# EAGLE design Adafruit NeoKey FeatherWing (EAGLE 9.6.2)
COMPANY: ADAFRUIT INDUSTRIES; DRAWN: KTOWN; REV: A
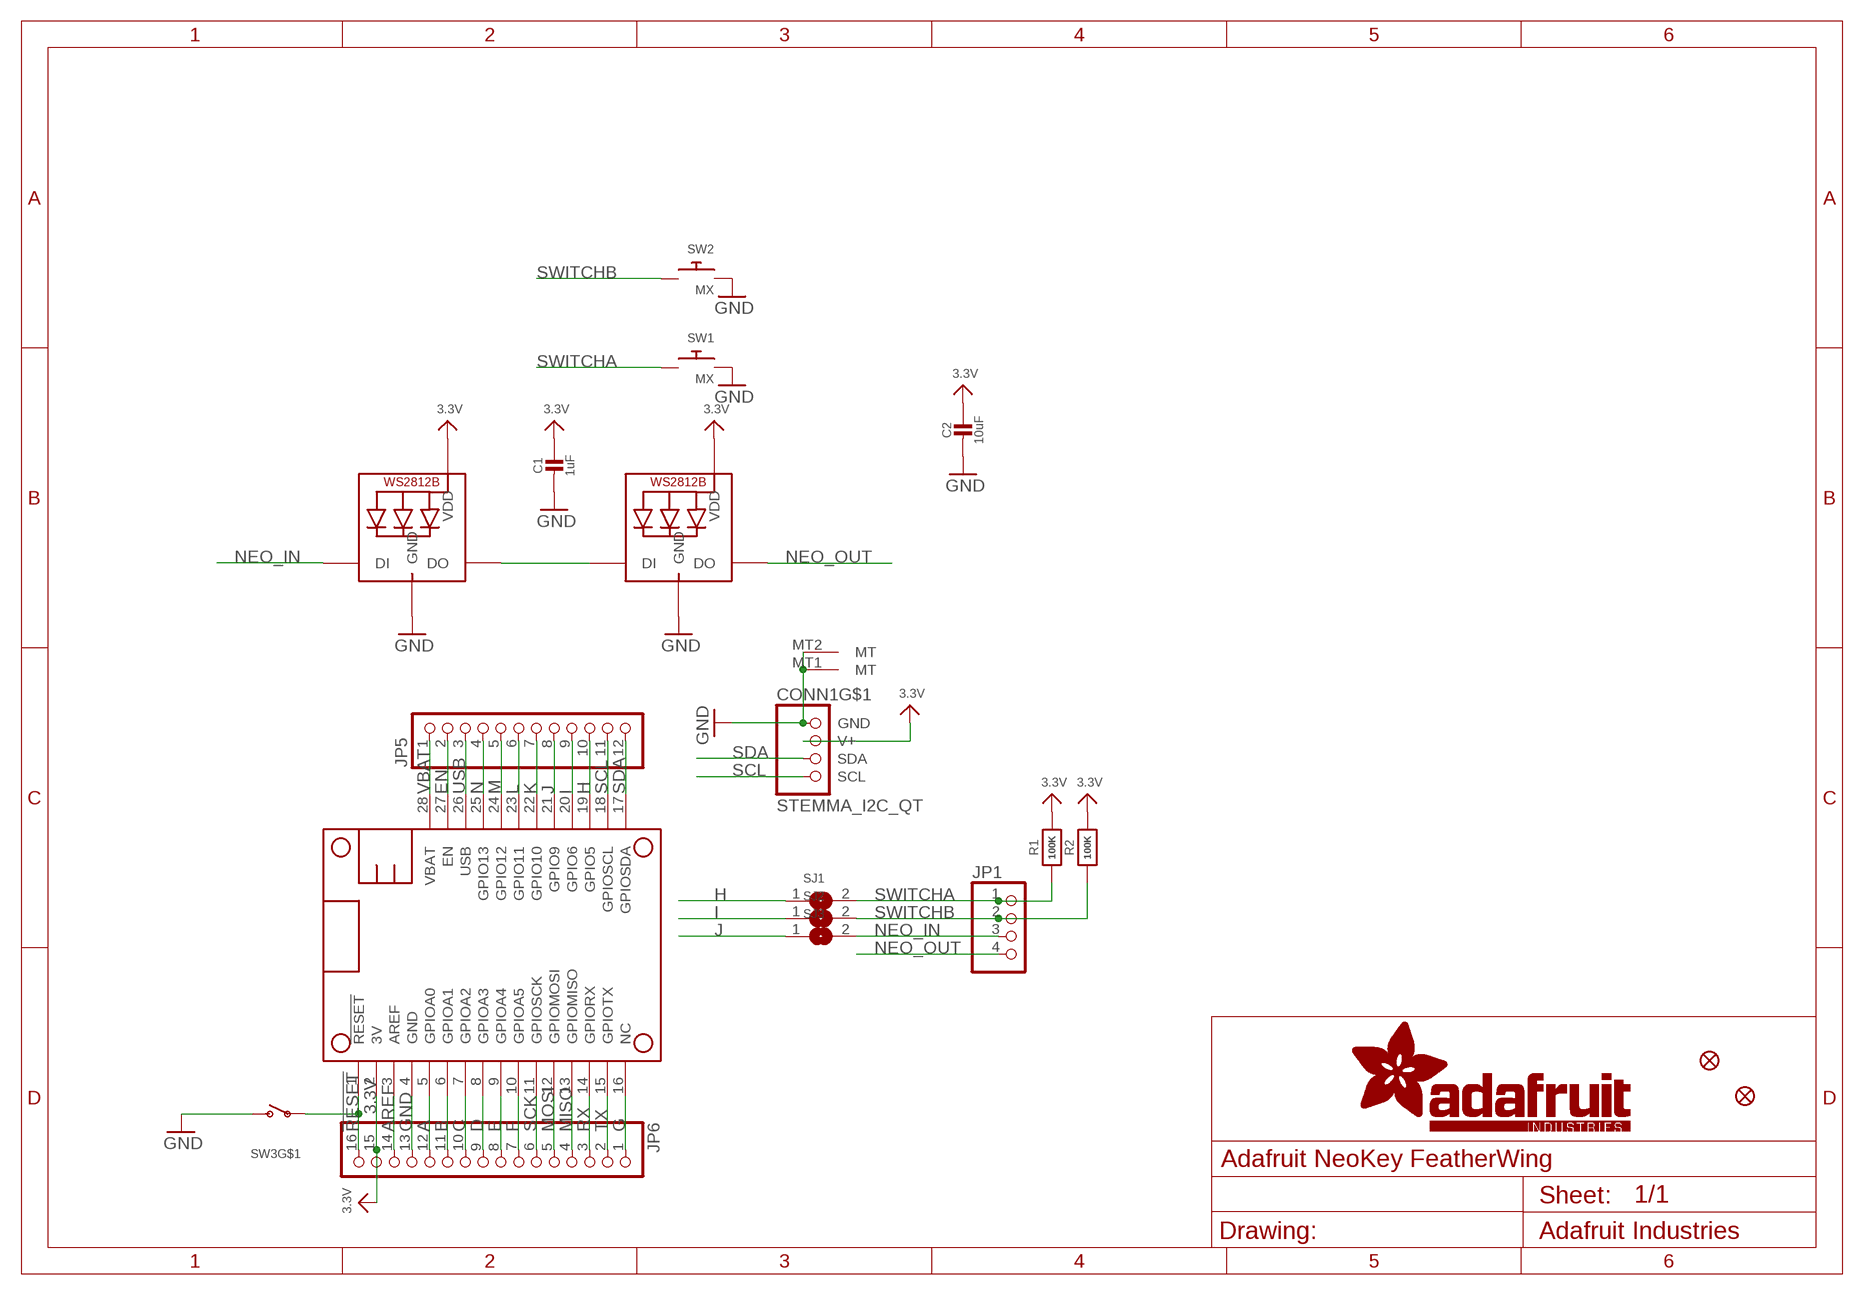
[diagram p0: schematic, sheet 1]

## Parts
C1  1uF  CAP_CERAMIC0603_NO  [0603-NO]
C2  10uF  CAP_CERAMIC0805-NOOUTLINE  [0805-NO]
CONN1  STEMMA_I2C_QT  [JST_SH4]
FID1  FIDUCIAL_1MM  [FIDUCIAL_1MM]
FID2  FIDUCIAL_1MM  [FIDUCIAL_1MM]
JP1  HEADER-1X4ROUND  [1X04_ROUND]
JP5  HEADER-1X12  [1X12_ROUND]
JP6  HEADER-1X16ROUND  [1X16_ROUND]
LED1  WS2812B_SK6812E  [NEO3535_REVERSE]
LED2  WS2812B_SK6812E  [NEO3535_REVERSE]
MS1  FEATHERWING_NODIM  [FEATHERWING_NODIM]
R1  100K  RESISTOR_0603_NOOUT  [0603-NO]
R2  100K  RESISTOR_0603_NOOUT  [0603-NO]
SJ1  SOLDERJUMPERCLOSED  [SOLDERJUMPER_CLOSEDWIRE]
SJ2  SOLDERJUMPERCLOSED  [SOLDERJUMPER_CLOSEDWIRE]
SJ3  SOLDERJUMPERCLOSED  [SOLDERJUMPER_CLOSEDWIRE]
SW1  MX  SWITCH_PUSHBUTTON_KAILH_SOCKET  [KAILH_SOCKET]
SW2  MX  SWITCH_PUSHBUTTON_KAILH_SOCKET  [KAILH_SOCKET]
SW3  SWITCH_SPST_TACT_RA  [SPST_TACTILE_RA]

## Nets
3.3V: C1.1 C2.1 CONN1.2(V+) JP6.15 LED1.1-VDD(VDD) LED2.1-VDD(VDD) MS1.2(3V) R1.2 R2.2
!RESET: JP6.16 MS1.1(!RESET) SW3.1(P)
A: JP6.12 MS1.5(GPIOA0)
AREF: JP6.14 MS1.3(AREF)
B: JP6.11 MS1.6(GPIOA1)
C: JP6.10 MS1.7(GPIOA2)
D: JP6.9 MS1.8(GPIOA3)
E: JP6.8 MS1.9(GPIOA4)
EN: JP5.2 MS1.27(EN)
F: JP6.7 MS1.10(GPIOA5)
G: JP6.1 MS1.16(NC)
GND: C1.2 C2.2 CONN1.1(GND) CONN1.MT1(MT) CONN1.MT2(MT) JP6.13 LED1.3-GND(GND) LED2.3-GND(GND) MS1.4(GND) SW1.1 SW2.1 SW3.2(S)
H: JP5.10 MS1.19(GPIO5) SJ1.1
I: JP5.9 MS1.20(GPIO6) SJ2.1
J: JP5.8 MS1.21(GPIO9) SJ3.1
K: JP5.7 MS1.22(GPIO10)
L: JP5.6 MS1.23(GPIO11)
M: JP5.5 MS1.24(GPIO12)
MISO: JP6.4 MS1.13(GPIOMISO)
MOSI: JP6.5 MS1.12(GPIOMOSI)
N: JP5.4 MS1.25(GPIO13)
N$26: LED1.4-DIN(DI) LED2.2-DOUT(DO)
NEO_IN: JP1.3 LED2.4-DIN(DI) SJ3.2
NEO_OUT: JP1.4 LED1.2-DOUT(DO)
RX: JP6.3 MS1.14(GPIORX)
SCK: JP6.6 MS1.11(GPIOSCK)
SCL: CONN1.4(SCL) JP5.11 MS1.18(GPIOSCL)
SDA: CONN1.3(SDA) JP5.12 MS1.17(GPIOSDA)
SWITCHA: JP1.1 R1.1 SJ1.2 SW1.2
SWITCHB: JP1.2 R2.1 SJ2.2 SW2.2
TX: JP6.2 MS1.15(GPIOTX)
USB: JP5.3 MS1.26(USB)
VBAT: JP5.1 MS1.28(VBAT)
Unconnected: SW3.MT1(MT) SW3.MT2(MT)

## Library data of the parts
C1 C2 = microbuilder:CAP_CERAMIC: Ceramic Capacitors For new designs, use the packages preceded by an '_' character since they are more reliable: The following footprints should be used on most boards: _0402 - Standard footprint for regular board layouts _0603 - Standard footprint for regular board layouts _0805 - Standard footprint for regular board layouts _1206 - Standard footprint for regular board layouts For extremely tight-pitch boards where space is at a premium, the following 'micro-pitch' footprints can be used (smaller pads, no silkscreen outline, etc.): _0402MP - Micro-pitch footprint for very dense/compact boards _0603MP - Micro-pitch footprint for very dense/compact boards _0805MP - Micro-pitch footprint for very dense/compact boards _1206MP - Micro-pitch footprint for very dense/compact boards
CONN1 = microbuilder:STEMMA_I2C
FID1 FID2 = microbuilder:FIDUCIAL: Fiducial Alignment Points Various fiducial points for machine vision alignment.; BOM: EXCLUDE
JP1 = microbuilder:HEADER-1X4: PIN HEADER
JP5 = microbuilder:HEADER-1X12
JP6 = microbuilder:HEADER-1X16: PIN HEADER
LED1 LED2 = microbuilder:WS2812B
MS1 = microbuilder:FEATHERWING
R1 R2 = microbuilder:RESISTOR: Resistors For new designs, use the packages preceded by an '_' character since they are more reliable: The following footprints should be used on most boards: _0402 - Standard footprint for regular board layouts _0603 - Standard footprint for regular board layouts _0805 - Standard footprint for regular board layouts _1206 - Standard footprint for regular board layouts For extremely tight-pitch boards where space is at a premium, the following 'micro-pitch' footprints can be used (smaller pads, no silkscreen outline, etc.): _0402MP - Micro-pitch footprint for very dense/compact boards _0603MP - Micro-pitch footprint for very dense/compact boards _0805MP - Micro-pitch footprint for very dense/compact boards _1206MP - Micro-pitch footprint for very dense/compact boards
SJ1-SJ3 = microbuilder:SOLDERJUMPER: SMD Solder JUMPER Solder the two pads together to create a connection, or remove the solder to break it. REFLOW - Use this footprint for solder paste and reflow ovens. WAVE - Use this footprint for hand-soldering (larger pads). CLOSED - Has a trace between the two pads to ensure it is closed by default. The trace needs to be cut to disable the jumper, and can be closed again by creating a solder bridge between the two pads.
SW1 SW2 = adafruit_electromech:SWITCH_PUSHBUTTON: Buttons SOFTTOUCHSMD_SJ - Soft touch temporary push button (Super Junk Akihabara) Compatible with SKPMANE010 [Mouser: 688-SKPMAN] C&K_KSS = Digikey: KSS221GLFS
SW3 = adafruit_electromech:SWITCH_SPST: Switch - SPST 4UCon 19192 (6.7x2.6mm SMT)

## Net classes
1 highpower: width 0.305 mm, drill 0.483 mm
2 lowpower: width 0.254 mm, drill 0.483 mm

## Board
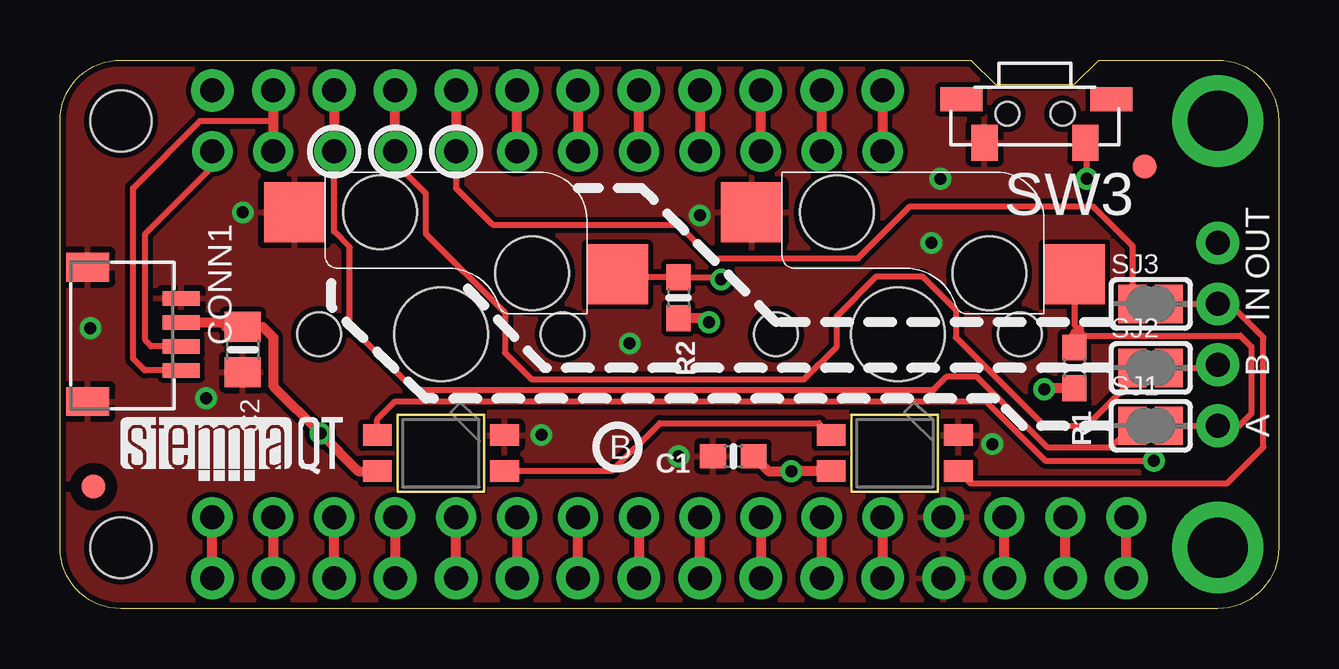
[diagram p1: board, top side]
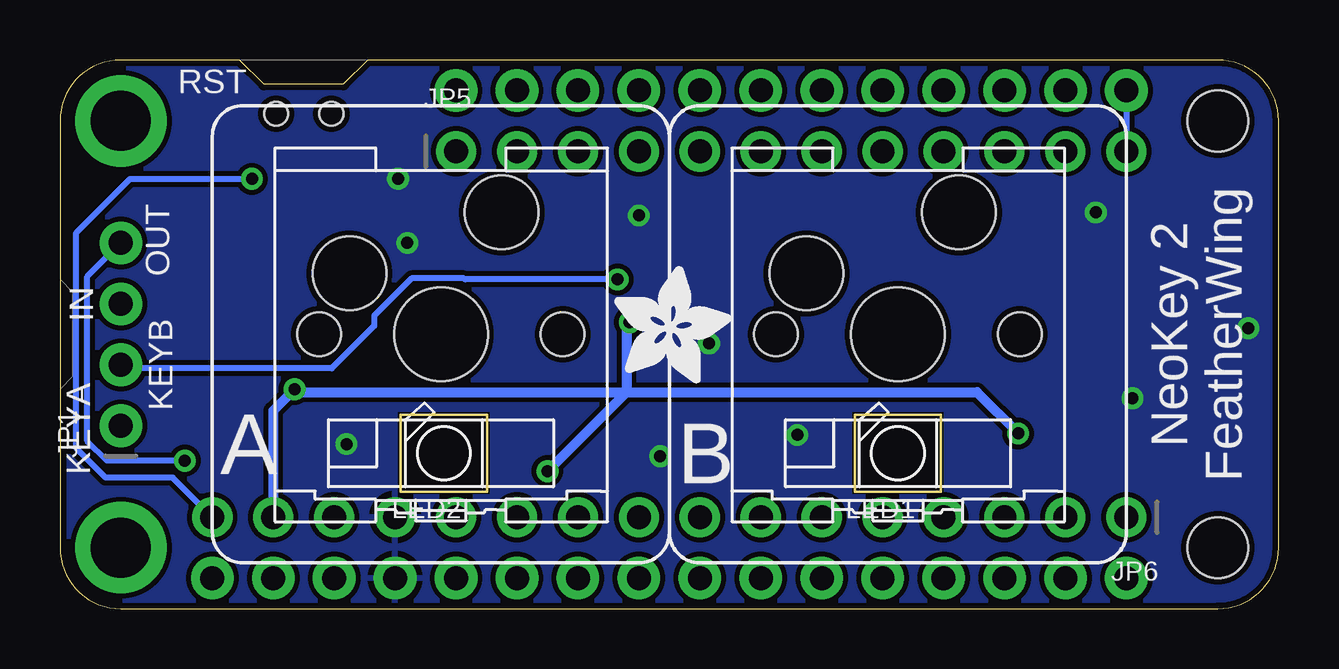
[diagram p2: board, bottom side, seen from below]

Size 50.8 x 22.86 mm. Coordinates in mm from the lower left corner, seen from the top.
Outline: 48.26,0 2.54,0 arc-90 0,2.54 0,20.32 arc-90 2.54,22.86 37.97,22.86 38.99,21.84 42.29,21.84 43.31,22.86 48.26,22.86 arc-90 50.8,20.32 50.8,2.54 arc-90 48.26,0
Copper layers (1*16): Top 0.035mm / dielectric 1.5mm / Bottom 0.035mm
Design rules "adafruit *": minimum track width 8mil, minimum drill 15.5mil, track to track 8mil, track to pad 8mil, pad to pad 8mil, via to via 8mil, smd to smd 8mil, copper to edge 10mil, drill to drill 8mil, minimum pad ring 10mil, minimum via ring 8mil, stop-mask expansion 2mil, vias tented up to drill 20mil, thermal gap 10mil

### Footprints (pad centres in the part's own frame; a part is rotated, then mirrored left to right if it is on the bottom)
0603-NO = smd 1.075 x 1: 1 -0.85,0; 2 0.85,0
0805-NO = smd 1.24 x 1.5: 1 -0.95,0; 2 0.95,0
JST_SH4 = smd 0.6 x 1.55: 1 -1.5,2.514; 2 -0.5,2.514; 3 0.5,2.514; 4 1.5,2.514 | smd 1.2 x 1.8: MT1 -2.8,-1.386; MT2 2.8,-1.386
FIDUCIAL_1MM = smd 1 x 1: 1 0,0
1X04_ROUND = drill 1 pad 1.778: 1 -3.81,0; 2 -1.27,0; 3 1.27,0; 4 3.81,0
1X12_ROUND = drill 1 pad 1.676: 1 -13.97,0; 2 -11.43,0; 3 -8.89,0; 4 -6.35,0; 5 -3.81,0; 6 -1.27,0; 7 1.27,0; 8 3.81,0; 9 6.35,0; 10 8.89,0; 11 11.43,0; 12 13.97,0
1X16_ROUND = drill 1 pad 1.676: 1 -19.05,0; 2 -16.51,0; 3 -13.97,0; 4 -11.43,0; 5 -8.89,0; 6 -6.35,0; 7 -3.81,0; 8 -1.27,0; 9 1.27,0; 10 3.81,0; 11 6.35,0; 12 8.89,0; 13 11.43,0; 14 13.97,0; 15 16.51,0; 16 19.05,0
NEO3535_REVERSE = smd 1.2 x 0.9 bottom: 1-VDD 2.65,-0.75; 2-DOUT 2.65,0.75; 3-GND -2.65,0.75; 4-DIN -2.65,-0.75
FEATHERWING_NODIM = drill 1 pad 1.778: 1 6.35,1.27; 2 8.89,1.27; 3 11.43,1.27; 4 13.97,1.27; 5 16.51,1.27; 6 19.05,1.27; 7 21.59,1.27; 8 24.13,1.27; 9 26.67,1.27; 10 29.21,1.27; 11 31.75,1.27; 12 34.29,1.27; 13 36.83,1.27; 14 39.37,1.27; 15 41.91,1.27; 16 44.45,1.27; 17 44.45,21.59; 18 41.91,21.59; 19 39.37,21.59; 20 36.83,21.59; 21 34.29,21.59; 22 31.75,21.59; 23 29.21,21.59; 24 26.67,21.59; 25 24.13,21.59; 26 21.59,21.59; 27 19.05,21.59; 28 16.51,21.59 | drill 2.5 pad 3.81: P$1 2.54,20.32; P$2 2.54,2.54 | hole 2.54: 48.26,20.32; 48.26,2.54
SOLDERJUMPER_CLOSEDWIRE = smd 1.168 x 1.6: 1 -0.762,0; 2 0.762,0 | smd 0.635 x 0.203: WIRE 0,0
KAILH_SOCKET = smd 2.55 x 2.5 bottom: 1 6.09,5.08; 2 -7.36,2.5 | hole 3.9: 0,0 | hole 3.063: 2.54,5.08; -3.81,2.54 | hole 1.813: 5.08,0; -5.08,0
SPST_TACTILE_RA = smd 1.1 x 1.5: 1 -2.1,0.9; 2 2.1,0.9 | smd 1.75 x 1: MT1 -3.175,-0.9; MT2 3.075,-0.9 | hole 1: -1.15,-0.3; 1.15,-0.3

### Placement (x,y rotation side)
C1  28.07,6.35 180 top
C2  7.62,10.79 270 top
CONN1  2.54,11.43 270 top
FID1  45.21,18.41 0 top
FID2  1.4,5.08 0 top
JP1  48.26,11.43 90 bottom
JP5  20.32,19.05 0 bottom
JP6  25.4,3.81 180 bottom
LED1  15.88,6.48 0 bottom
LED2  34.8,6.48 0 bottom
MS1  50.8,0 0 bottom
R1  42.29,10.03 270 top
R2  25.78,12.95 270 top
SJ1  45.47,7.62 0 top
SJ2  45.47,10.03 0 top
SJ3  45.47,12.7 0 top
SW1  34.92,11.43 0 bottom
SW2  15.88,11.43 0 bottom
SW3  40.64,20.32 180 top
U$7  [ADAFRUIT_5MM]  27.69,9.4 0 bottom
U$8  [PCBFEAT-REV-040]  23.24,6.73 0 top
U$11  [STEMMAQT]  2.54,5.33 0 top

### Tracks (layer width: path | path; a pad name or v marks a point on that pad's centre or on a via)
3.3V  (via drill 0.5)
  Top 0.406: MS1.2 JP6.15 | LED2.1-VDD v30.48,5.73 29.54,5.73 C1.1 | v27.05,11.94 26.92,11.94 26.76,12.1 R2.2 | CONN1.2 6.74,11.93 6.92,11.74 C2.1 8.45,11.74 8.89,11.3 8.89,9.27 v10.86,7.3 12.43,5.73 LED1.1-VDD | R1.2 41.06,9.18 v41.02,9.14
  Bottom 0.406: v30.48,5.73 27.19,9.02 | v27.05,11.94 27.18,11.81 27.18,9.03 | 27.18,9.03 27.18,9.02 12.57,9.02 v10.86,7.3 | v41.02,9.14 41.15,9.02 | JP6.15 41.91,8.26 41.15,9.02 | 27.19,9.02 27.18,9.03 | 41.15,9.02 27.19,9.02
!RESET  (via drill 0.5)
  Top 0.254: v42.8,17.91 42.8,19.36 SW3.1
  Top 0.406: MS1.1 JP6.16
  Bottom 0.254: JP6.16 46.1,5.46 48.9,5.46 50.11,6.68 50.11,15.67 47.88,17.91 v42.8,17.91
A
  Top 0.406: JP6.12 MS1.5
AREF
  Top 0.406: MS1.3 JP6.14
B
  Top 0.406: MS1.6 JP6.11
C
  Top 0.406: JP6.10 MS1.7
D
  Top 0.406: MS1.8 JP6.9
E
  Top 0.406: JP6.8 MS1.9
EN
  Top 0.406: JP5.2 MS1.27
F
  Top 0.406: MS1.10 JP6.7
G
  Top 0.406: MS1.16 JP6.1
GND  (via drill 0.5)
  other vias: 26.67,16.38 7.62,16.51 38.86,6.86 20.07,7.24 25.78,6.35 1.27,11.68 36.7,17.91 6.1,8.76 23.75,11.05 36.32,15.24
  pour Top: 50.8,22.86 0,22.86 0,0 50.8,0
  pour Bottom: 50.8,22.86 0,22.86 0,0 50.8,0
H
  Top 0.254: SJ1.1 43.81,6.73 41.15,6.73 38.23,9.65 36.95,9.65 36.39,9.09 14.78,9.09 12.08,11.79 12.08,15.06 11.42,15.72 11.42,17.3 11.43,17.31 JP5.10
  Top 0.406: MS1.19 JP5.10
I
  Top 0.254: JP5.9 13.97,18.58 15.25,17.3 15.25,15.61 18.54,12.32 18.54,10.67 19.66,9.55 31.01,9.55 32.38,10.92 32.38,12.19 34.04,13.84 35.94,13.84 37.34,12.45 37.34,11.3 41.02,7.62 42.8,7.62 44.7,9.53 SJ2.1
  Top 0.406: JP5.9 MS1.20
J
  Top 0.254: JP5.8 16.51,17.53 18.03,16 25.78,16 27.19,14.6 33.27,14.6 35.43,16.76 43.05,16.76 44.7,15.11 SJ3.1
  Top 0.406: MS1.21 JP5.8
K
  Top 0.406: JP5.7 MS1.22
L
  Top 0.406: MS1.23 JP5.6
M
  Top 0.406: JP5.5 MS1.24
MISO
  Top 0.406: JP6.4 MS1.13
MOSI
  Top 0.406: MS1.12 JP6.5
N
  Top 0.406: MS1.25 JP5.4
N$26
  Top 0.254: LED2.2-DOUT 31.64,7.74 25.01,7.74 23,5.73 LED1.4-DIN
NEO_IN
  Top 0.254: SJ3.2 JP1.3 48.77,12.7 50.16,11.3 50.16,6.73 48.65,5.22 37.96,5.22 LED2.4-DIN
NEO_OUT  (via drill 0.5)
  Top 0.254: LED1.2-DOUT 13.22,7.89 13.97,8.64 38.6,8.64 41.07,6.16 v45.59,6.16
  Bottom 0.254: JP1.4 49.66,13.84 49.66,6.99 48.84,6.16 v45.59,6.16
RX
  Top 0.406: MS1.14 JP6.3
SCK
  Top 0.406: JP6.6 MS1.11
SCL
  Top 0.254: CONN1.4 3.53,9.93 3.05,10.41 3.05,17.53 5.84,20.32 8.89,20.32
  Top 0.406: MS1.18 8.89,20.32 JP5.11
SDA
  Top 0.254: CONN1.3 3.8,10.93 3.56,11.18 3.56,15.62 6.35,18.41 JP5.12
  Bottom 0.254: MS1.17 JP5.12
SWITCHA
  Top 0.254: SJ1.2 JP1.1 49.15,7.62 49.66,8.13 49.66,10.92 49.2,11.38 42.72,11.38 42.48,11.62 42.28,11.82 SW1.2
  Top 0.406: R1.1 42.29,11.43 42.48,11.62
SWITCHB  (via drill 0.5)
  Top 0.254: SW2.2 23.66,13.93 23.88,13.72 23.69,13.53 23.69,13.8 R2.1 27.47,13.8 v27.56,13.72 | SJ2.2 48.13,10.03 JP1.2
  Bottom 0.254: v27.56,13.72 33.91,13.72 33.96,13.76 36.15,13.76 37.7,12.21 37.7,11.79 39.47,10.02 48.12,10.02 JP1.2
TX
  Top 0.406: JP6.2 MS1.15
USB
  Top 0.406: JP5.3 MS1.26
VBAT
  Top 0.406: MS1.28 JP5.1

### Text on the board
tPlace: OUT | IN | B | A
bPlace: RST | OUT | IN | NeoKey 2 / FeatherWing | KEYB | A | KEYA | B